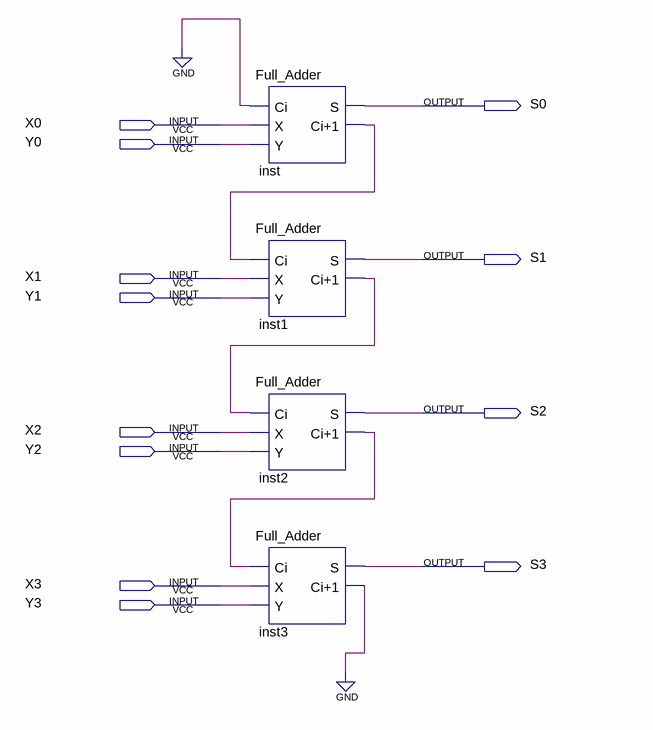
[diagram p0: schematic sheet]
// Quartus schematic 4bits_Adder.bdf as structural Verilog: 4 symbols, 12 pins
module \4bits_Adder  (
  input  X0,
  input  Y0,
  input  X1,
  input  Y1,
  input  X2,
  input  Y2,
  input  X3,
  input  Y3,
  output S0,
  output S1,
  output S2,
  output S3
);

  wire inst1_ci_1, inst2_ci_1, inst3_ci_1, inst_ci_1;

  Full_Adder inst (.Ci(1'b0), .X(X0), .Y(Y0), .S(S0), .\Ci+1 (inst_ci_1));
  Full_Adder inst1 (.Ci(inst_ci_1), .X(X1), .Y(Y1), .S(S1), .\Ci+1 (inst1_ci_1));
  Full_Adder inst2 (.Ci(inst1_ci_1), .X(X2), .Y(Y2), .S(S2), .\Ci+1 (inst2_ci_1));
  Full_Adder inst3 (.Ci(inst2_ci_1), .X(X3), .Y(Y3), .S(S3), .\Ci+1 (inst3_ci_1));
  // also tied to GND on the sheet: inst3_ci_1
endmodule
